# Altium project BLDC_MOTOR_Driver_stm32f446re.PrjPcb (part 1 of 2)
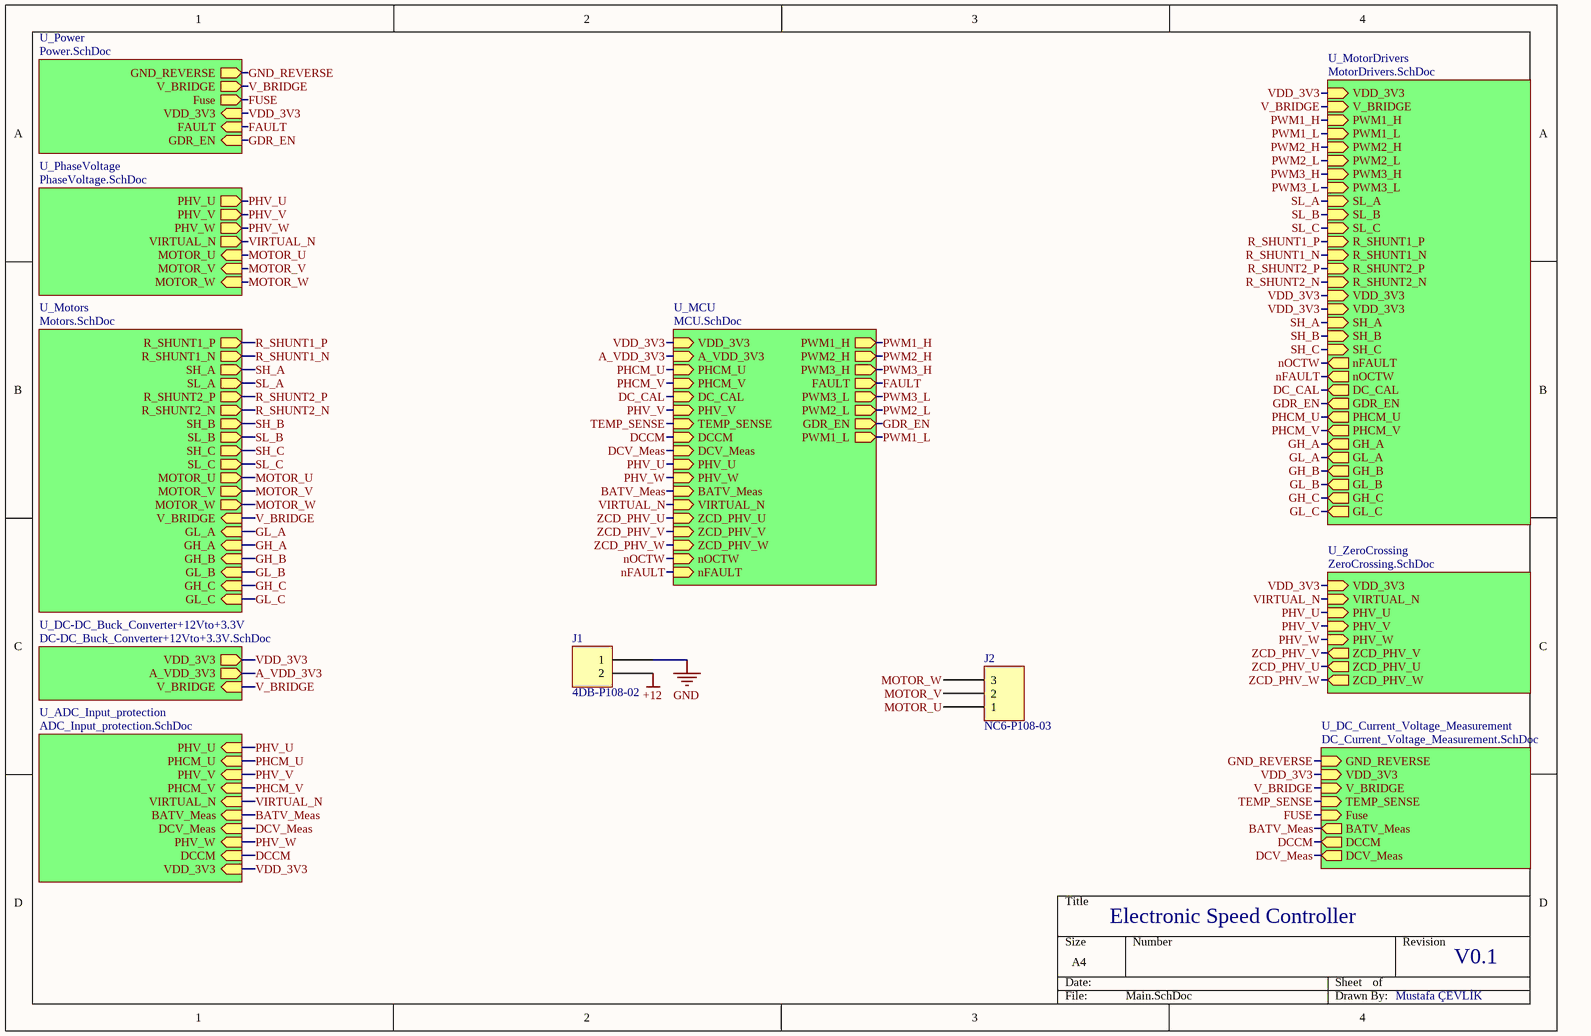
[diagram p0: Main.SchDoc]
10 sheets, 166 parts. Net scope: global (net labels, ports and power ports of the same name join across sheets).
Board file: PCB1.PcbDoc
Sheets:
  Main.SchDoc
    U_Power = Power.SchDoc
    U_PhaseVoltage = PhaseVoltage.SchDoc
    U_Motors = Motors.SchDoc
    U_DC-DC_Buck_Converter+12Vto+3.3V = DC-DC_Buck_Converter+12Vto+3.3V.SchDoc
    U_ADC_Input_protection = ADC_Input_protection.SchDoc
    U_MotorDrivers = MotorDrivers.SchDoc
    U_ZeroCrossing = ZeroCrossing.SchDoc
    U_DC_Current_Voltage_Measurement = DC_Current_Voltage_Measurement.SchDoc
    U_MCU = MCU.SchDoc

## Sheet Main.SchDoc
size A4; SheetNumber: 1; SheetTotal: 10

### Parts
J1  4DB-P108-02  [TE 4DB-P108-02]
J2  NC6-P108-03  [TE NC6-P108-03]

### Sub-sheets
U_ADC_Input_protection = ADC_Input_protection.SchDoc: PHV_U (in), PHCM_U (in), PHV_V (in), PHCM_V (in), VIRTUAL_N (in), BATV_Meas (in), DCV_Meas (in), PHV_W (in), DCCM (in), VDD_3V3 (in)
U_DC-DC_Buck_Converter+12Vto+3.3V = DC-DC_Buck_Converter+12Vto+3.3V.SchDoc: V_BRIDGE (in), VDD_3V3 (out), A_VDD_3V3 (out)
U_DC_Current_Voltage_Measurement = DC_Current_Voltage_Measurement.SchDoc: DCCM (out), GND_REVERSE (in), VDD_3V3 (in), BATV_Meas (out), V_BRIDGE (in), DCV_Meas (out), TEMP_SENSE (in), Fuse (in)
U_MCU = MCU.SchDoc: VDD_3V3 (in), A_VDD_3V3 (in), PHCM_U (in), PHCM_V (in), DC_CAL (in), PHV_V (in), TEMP_SENSE (in), PWM1_H (out), PWM2_H (out), PWM3_H (out), DCCM (in), DCV_Meas (in), PHV_U (in), FAULT (out), PWM3_L (out), PHV_W (in), BATV_Meas (in), PWM2_L (out), VIRTUAL_N (in), ZCD_PHV_U (in), ZCD_PHV_V (in), ZCD_PHV_W (in), nOCTW (in), nFAULT (in), GDR_EN (out), PWM1_L (out)
U_MotorDrivers = MotorDrivers.SchDoc: VDD_3V3 (in), V_BRIDGE (in), nFAULT (out), nOCTW (out), DC_CAL (out), GDR_EN (out), PWM1_H (in), PWM1_L (in), PWM2_H (in), PWM2_L (in), PWM3_H (in), PWM3_L (in), PHCM_U (out), PHCM_V (out), GH_A (out), GL_A (out), SL_A (in), GH_B (out), GL_B (out), SL_B (in), GH_C (out), GL_C (out), SL_C (in), R_SHUNT1_P (in), R_SHUNT1_N (in), R_SHUNT2_P (in), R_SHUNT2_N (in), VDD_3V3 (in), VDD_3V3 (in), SH_A (in), SH_B (in), SH_C (in)
U_Motors = Motors.SchDoc: V_BRIDGE (in), R_SHUNT1_P (out), R_SHUNT1_N (out), GL_A (in), SH_A (out), SL_A (out), GH_A (in), R_SHUNT2_P (out), R_SHUNT2_N (out), SH_B (out), SL_B (out), GH_B (in), GL_B (in), SH_C (out), SL_C (out), GH_C (in), GL_C (in), MOTOR_U (out), MOTOR_V (out), MOTOR_W (out)
U_PhaseVoltage = PhaseVoltage.SchDoc: MOTOR_U (in), MOTOR_V (in), MOTOR_W (in), PHV_U (out), PHV_V (out), PHV_W (out), VIRTUAL_N (out)
U_Power = Power.SchDoc: GND_REVERSE (out), V_BRIDGE (out), VDD_3V3 (in), FAULT (in), GDR_EN (in), Fuse (out)
U_ZeroCrossing = ZeroCrossing.SchDoc: VDD_3V3 (in), VIRTUAL_N (in), ZCD_PHV_U (out), PHV_U (in), ZCD_PHV_V (out), PHV_V (in), ZCD_PHV_W (out), PHV_W (in)

### Nets
+12: J1.2
R_SHUNT1_N: J1.1 ; sheet U_Motors/R_SHUNT1_N, sheet U_Motors/R_SHUNT2_N, sheet U_MotorDrivers/R_SHUNT1_N, sheet U_MotorDrivers/R_SHUNT2_N  [also labelled GND, R_SHUNT2_N]
A_VDD_3V3: sheet U_DC-DC_Buck_Converter+12Vto+3.3V/A_VDD_3V3, sheet U_MCU/A_VDD_3V3
BATV_Meas: sheet U_ADC_Input_protection/BATV_Meas, sheet U_DC_Current_Voltage_Measurement/BATV_Meas, sheet U_MCU/BATV_Meas
DC_CAL: sheet U_MotorDrivers/DC_CAL, sheet U_MCU/DC_CAL
DCCM: sheet U_ADC_Input_protection/DCCM, sheet U_DC_Current_Voltage_Measurement/DCCM, sheet U_MCU/DCCM
DCV_Meas: sheet U_ADC_Input_protection/DCV_Meas, sheet U_DC_Current_Voltage_Measurement/DCV_Meas, sheet U_MCU/DCV_Meas
FAULT: sheet U_Power/FAULT, sheet U_MCU/FAULT
FUSE: sheet U_Power/Fuse, sheet U_DC_Current_Voltage_Measurement/Fuse
GDR_EN: sheet U_Power/GDR_EN, sheet U_MotorDrivers/GDR_EN, sheet U_MCU/GDR_EN
GH_A: sheet U_Motors/GH_A, sheet U_MotorDrivers/GH_A
GH_B: sheet U_Motors/GH_B, sheet U_MotorDrivers/GH_B
GH_C: sheet U_Motors/GH_C, sheet U_MotorDrivers/GH_C
GL_A: sheet U_Motors/GL_A, sheet U_MotorDrivers/GL_A
GL_B: sheet U_Motors/GL_B, sheet U_MotorDrivers/GL_B
GL_C: sheet U_Motors/GL_C, sheet U_MotorDrivers/GL_C
GND_REVERSE: sheet U_Power/GND_REVERSE, sheet U_DC_Current_Voltage_Measurement/GND_REVERSE
MOTOR_U: J2.1 ; sheet U_PhaseVoltage/MOTOR_U, sheet U_Motors/SH_A, sheet U_Motors/MOTOR_U, sheet U_MotorDrivers/SH_A  [also labelled SH_A]
MOTOR_V: J2.2 ; sheet U_PhaseVoltage/MOTOR_V, sheet U_Motors/SH_B, sheet U_Motors/MOTOR_V, sheet U_MotorDrivers/SH_B  [also labelled SH_B]
MOTOR_W: J2.3 ; sheet U_PhaseVoltage/MOTOR_W, sheet U_Motors/SH_C, sheet U_Motors/MOTOR_W, sheet U_MotorDrivers/SH_C  [also labelled SH_C]
nFAULT: sheet U_MotorDrivers/nOCTW, sheet U_MCU/nFAULT
nOCTW: sheet U_MotorDrivers/nFAULT, sheet U_MCU/nOCTW
PHCM_U: sheet U_ADC_Input_protection/PHCM_U, sheet U_MotorDrivers/PHCM_U, sheet U_MCU/PHCM_U
PHCM_V: sheet U_ADC_Input_protection/PHCM_V, sheet U_MotorDrivers/PHCM_V, sheet U_MCU/PHCM_V
PHV_U: sheet U_PhaseVoltage/PHV_U, sheet U_ADC_Input_protection/PHV_U, sheet U_ZeroCrossing/PHV_U, sheet U_MCU/PHV_U
PHV_V: sheet U_PhaseVoltage/PHV_V, sheet U_ADC_Input_protection/PHV_V, sheet U_ZeroCrossing/PHV_V, sheet U_MCU/PHV_V
PHV_W: sheet U_PhaseVoltage/PHV_W, sheet U_ADC_Input_protection/PHV_W, sheet U_ZeroCrossing/PHV_W, sheet U_MCU/PHV_W
PWM1_H: sheet U_MotorDrivers/PWM1_H, sheet U_MCU/PWM1_H
PWM1_L: sheet U_MotorDrivers/PWM1_L, sheet U_MCU/PWM1_L
PWM2_H: sheet U_MotorDrivers/PWM2_H, sheet U_MCU/PWM2_H
PWM2_L: sheet U_MotorDrivers/PWM2_L, sheet U_MCU/PWM2_L
PWM3_H: sheet U_MotorDrivers/PWM3_H, sheet U_MCU/PWM3_H
PWM3_L: sheet U_MotorDrivers/PWM3_L, sheet U_MCU/PWM3_L
R_SHUNT1_P: sheet U_Motors/R_SHUNT1_P, sheet U_Motors/SL_A, sheet U_MotorDrivers/SL_A, sheet U_MotorDrivers/R_SHUNT1_P  [also labelled SL_A]
R_SHUNT2_P: sheet U_Motors/R_SHUNT2_P, sheet U_Motors/SL_B, sheet U_MotorDrivers/SL_B, sheet U_MotorDrivers/R_SHUNT2_P  [also labelled SL_B]
SL_C: sheet U_Motors/SL_C, sheet U_MotorDrivers/SL_C
TEMP_SENSE: sheet U_DC_Current_Voltage_Measurement/TEMP_SENSE, sheet U_MCU/TEMP_SENSE
V_BRIDGE: sheet U_Power/V_BRIDGE, sheet U_Motors/V_BRIDGE, sheet U_DC-DC_Buck_Converter+12Vto+3.3V/V_BRIDGE, sheet U_MotorDrivers/V_BRIDGE, sheet U_DC_Current_Voltage_Measurement/V_BRIDGE
VDD_3V3: sheet U_Power/VDD_3V3, sheet U_DC-DC_Buck_Converter+12Vto+3.3V/VDD_3V3, sheet U_ADC_Input_protection/VDD_3V3, sheet U_MotorDrivers/VDD_3V3, sheet U_MotorDrivers/VDD_3V3, sheet U_MotorDrivers/VDD_3V3, sheet U_ZeroCrossing/VDD_3V3, sheet U_DC_Current_Voltage_Measurement/VDD_3V3, sheet U_MCU/VDD_3V3
VIRTUAL_N: sheet U_PhaseVoltage/VIRTUAL_N, sheet U_ADC_Input_protection/VIRTUAL_N, sheet U_ZeroCrossing/VIRTUAL_N, sheet U_MCU/VIRTUAL_N
ZCD_PHV_U: sheet U_ZeroCrossing/ZCD_PHV_U, sheet U_MCU/ZCD_PHV_U
ZCD_PHV_V: sheet U_ZeroCrossing/ZCD_PHV_V, sheet U_MCU/ZCD_PHV_V
ZCD_PHV_W: sheet U_ZeroCrossing/ZCD_PHV_W, sheet U_MCU/ZCD_PHV_W

### Notes on the sheet
- Electronic Speed Controller
- V0.1
- Mustafa ÇEVLİK

### Library data of the parts
J1 = 4DB-P108-02: CONN BARRIER STRIP 2CIRC 0.325"; Manufacturer: TE Connectivity AMP Connectors; Barrier Type: 2 Wall (Dual); Bottom Termination: PC Pin; Current Rating (Amps): 20A; Number of Circuits: 2; Pitch: 0.325" (8.26mm); Top Termination: Screws with Captive Plate; Voltage Rating: 150V; Wire Gauge: 12-22 AWG; Part Number: 4DB-P108-02; Color: Black; ComponentLink1Description: Datasheet; ComponentLink1URL: https://www.te.com/commerce/DocumentDelivery/DDEController?Action=srchrtrv&DocNm=2-1437667-4&DocType=Customer+Drawing&DocLang=English; ComponentLink2Description: DigiKey Link; ComponentLink2URL: http://digikey.com/product-detail/en/te-connectivity-amp-connectors/4DB-P108-02/A98472-ND/1277921; LastUpdated: 15.01.2020 04:14:08; Lifecycle Status: Active; Minimum Order: 1; Number of Rows: 1; Number of Wire Entries: 2; Packaging: Bulk; Part Status: Active; Price: 1.04; Series: 4DB, Buchanan; Supplier 1: DigiKey; Supplier Part Number 1: A98472-ND; Terminal Block Type: Barrier Block
J2 = NC6-P108-03: CONN BARRIER STRIP 3CIRC 0.375"; Manufacturer: TE Connectivity AMP Connectors; Barrier Type: 2 Wall (Dual); Bottom Termination: PC Pin; Current Rating (Amps): 20A; Number of Circuits: 3; Pitch: 0.375" (9.53mm); Top Termination: Screws with Captive Plate; Voltage Rating: 300V; Wire Gauge: 12-22 AWG; Part Number: NC6-P108-03; Color: Black; ComponentLink1Description: Datasheet; ComponentLink1URL: https://www.te.com/commerce/DocumentDelivery/DDEController?Action=srchrtrv&DocNm=3-1437664-0&DocType=Customer+Drawing&DocLang=English; ComponentLink2Description: DigiKey Link; ComponentLink2URL: http://digikey.com/product-detail/en/te-connectivity-amp-connectors/NC6-P108-03/A98496-ND/1277927; LastUpdated: 15.01.2020 04:12:05; Lifecycle Status: Active; Minimum Order: 1; Number of Rows: 1; Number of Wire Entries: 3; Packaging: Bulk; Part Status: Active; Price: 2.16; Series: NC6, Buchanan; Supplier 1: DigiKey; Supplier Part Number 1: A98496-ND; Terminal Block Type: Barrier Block

## Sheet Power.SchDoc
size A4; SheetNumber: 2; SheetTotal: 10
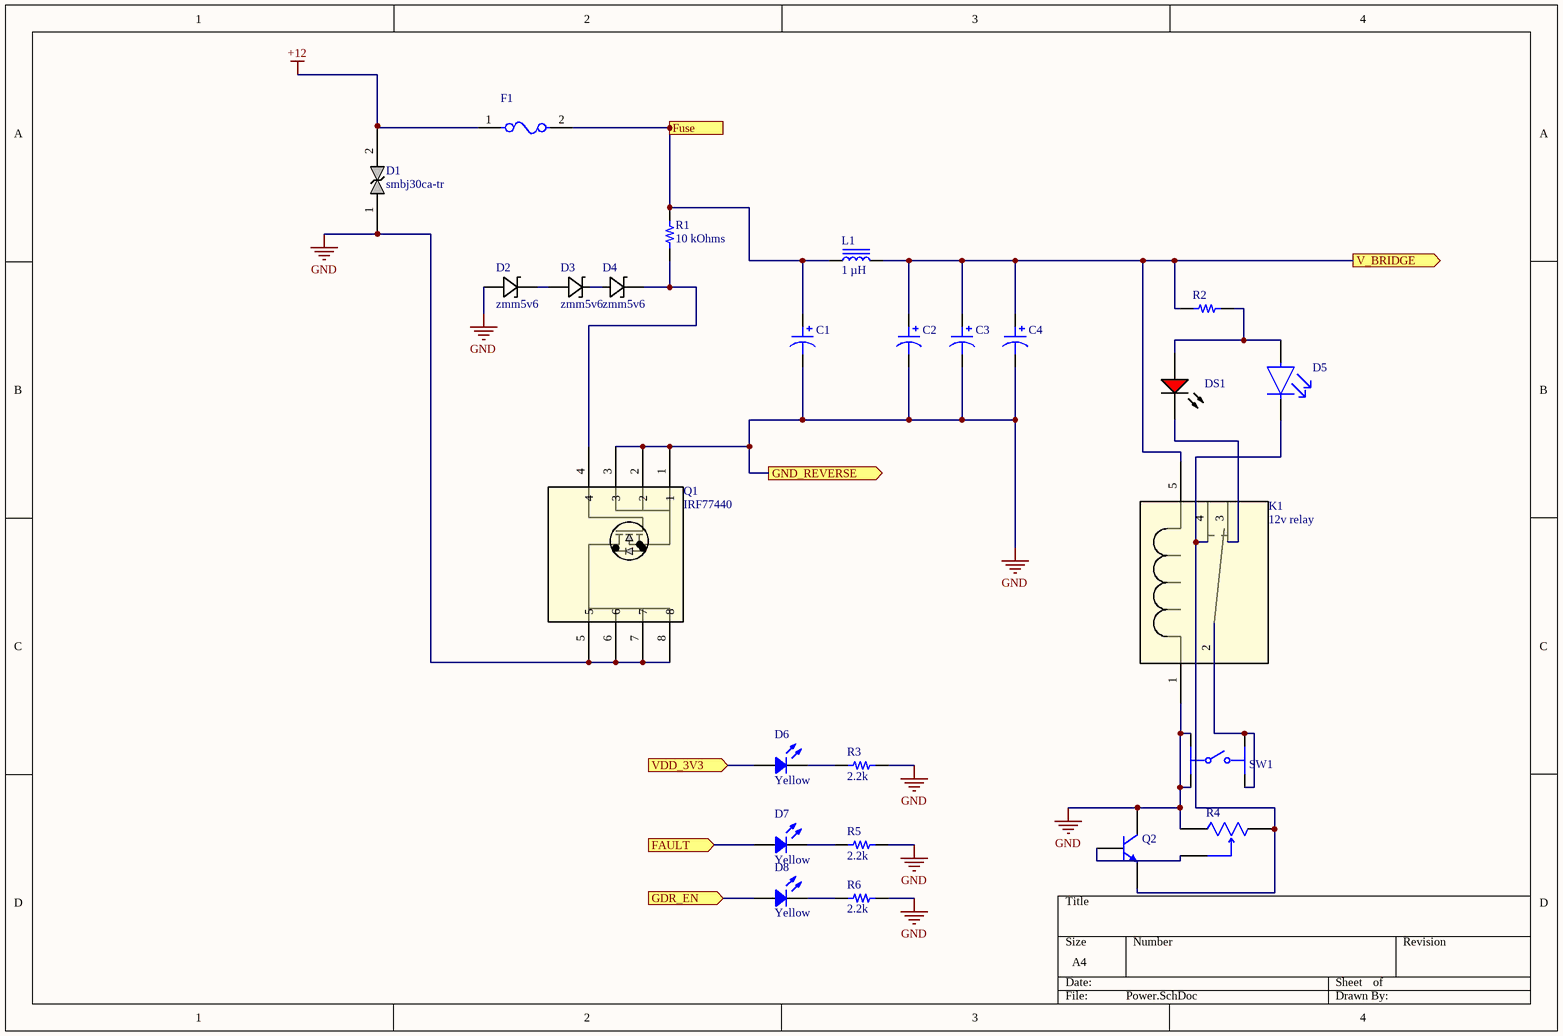
[diagram p1: Power.SchDoc]

### Parts
C1  100 µF  [CAP POL 1411_3528]  (value not drawn)
C2  100 µF  [CAP POL 1411_3528]  (value not drawn)
C3  100 µF  [CAP POL 1411_3528]  (value not drawn)
C4  100 µF  [CAP POL 1411_3528]  (value not drawn)
D1  smbj30ca-tr  [smbj30ca-tr]
D2  zmm5v6  [zmm5v6]
D3  zmm5v6  [zmm5v6]
D4  zmm5v6  [zmm5v6]
D5  LTST-C190GKT  [FP-LTST-C190GKT-MFG]  (value not drawn)
D6  Yellow  [LED 0402_1005 YELLOW]
D7  Yellow  [LED 0402_1005 YELLOW]
D8  Yellow  [LED 0402_1005 YELLOW]
DS1  TLMS1100-GS08  [VISH-TLMX1100_V]  (value not drawn)
F1  SF-2923UC60C-2  [FP-SF-2923-MFG]  (value not drawn)
K1  12v relay  [12V relay]
L1  1 µH  [WURTH WE-HCI 7040]
Q1  IRF77440  [IRF77440]
Q2  BC547B  [ONSC-TO-92-3-29-11]  (value not drawn)
R1  10 kOhms  [RES 0603_1608]
R2  1 kOhms  [RES 1206_3216]  (value not drawn)
R3  2.2k  [RES 0603_1608]
R4  TS53YJ104MR10  [FP-TS53YJ-MFG]  (value not drawn)
R5  2.2k  [RES 0603_1608]
R6  2.2k  [RES 0603_1608]
SW1  3-1825910-1  [FP-3-1825910-1-MFG]  (value not drawn)

### Ports
FAULT (in, see MCU[3C]), Fuse (out, see DC_Current_Voltage_Measurement[2B]), GDR_EN (in, see MCU[3B], MotorDrivers[1B]), GND_REVERSE (out, see DC_Current_Voltage_Measurement[2A]), V_BRIDGE (out, see DC-DC_Buck_Converter+12Vto+3.3V[1A], DC_Current_Voltage_Measurement[3B], MotorDrivers[3C], Motors[1A]), VDD_3V3 (in, see ADC_Input_protection[3C], DC-DC_Buck_Converter+12Vto+3.3V[3C], DC_Current_Voltage_Measurement[3B], MCU[1B], MotorDrivers[1A], MotorDrivers[1B], ZeroCrossing[1A])

### Nets
+12: D1.2 F1.1
GND: C1.2 C2.2 C3.2 C4.2 D1.1 D2.2(ANODE) K1.1 Q1.1 Q1.2 Q1.3 Q1.5 Q1.6 Q1.7 Q1.8 Q2.1(C) R3.1 R4.1(a) R5.1 R6.1 SW1.1 SW1.2 ; port GND_REVERSE  [project net R_SHUNT1_N]
GDR_EN: D8.1 ; port GDR_EN
NetC1_1: C1.1 F1.2 L1.1 R1.2 ; port Fuse
NetC2_1: C2.1 C3.1 C4.1 K1.5 L1.2 R2.2 ; port V_BRIDGE
NetC11_1: D6.1 ; port VDD_3V3
NetD2_1: D2.1(CATHODE) D3.2(ANODE)
NetD3_1: D3.1(CATHODE) D4.2(ANODE)
NetD4_1: D4.1(CATHODE) Q1.4 R1.1
NetD5_1: D5.1(C) K1.4 Q2.3(E) R4.3(c)
NetD5_2: D5.2(A) DS1.1(A) R2.1
NetD6_2: D6.2 R3.2
NetD7_1: D7.1 ; port FAULT
NetD7_2: D7.2 R5.2
NetD8_2: D8.2 R6.2
NetDS1_2: DS1.2(K) K1.3
NetK1_2: K1.2 SW1.3 SW1.4
NetQ2_2: Q2.2(B) R4.2(b)

### Library data of the parts
C1-C4 = T495B107M006ATE700: CAP TANT 100UF 20% 6.3V 1411; manufacturer: KEMET; Manufacturer Size Code: B; ESR (Equivalent Series Resistance): 700mOhm; Lifetime @ Temp.: 2000 Hrs @ 85°C; Type: Molded; Part Number: T495B107M006ATE700; Value: 100 µF; Capacitance: 100 µF; componentlink1description: Datasheet; componentlink1url: https://api.kemet.com/component-edge/download/datasheet/T495B107M006ATE700.pdf; componentlink2description: DigiKey Link; componentlink2url: https://www.digikey.com/en/products/detail/kemet/T495B107M006ATE700/818735; Device Package: 1411 (3528 Metric); Features: General Purpose; Height - Seated (Max): 0.083" (2.10mm); lastupdated: 3.10.2023 19:55:50; Lifecycle Status: Active; Minimum Order: 1; Mounting Type: Surface Mount; Operating Temperature: -55°C ~ 125°C; Package / Case: 1411 (3528 Metric); packaging: TapeAndReel; partid: 29; Part Status: Active; price: 0.54; series: T495; Size / Dimension: 0.138" L x 0.110" W (3.50mm x 2.80mm); Supplier 1: DigiKey; Supplier Part Number 1: 399-3875-1-ND; Tolerance: ±20%; Voltage - Rated: 6.3 V
D5 = CMP-22017-000005-2: LED GREEN CLEAR CHIP SMD; Dominant Wavelength: 569nm; Reverse Voltage: 5V; Lens Color: Colorless; Viewing Angle: 130°; Voltage: 2V; Forward Current: 30mA; Power Dissipation: 100mW; Luminous Intensity: 6mcd; Number of LEDs: 1; Forward Voltage: 2.1V; Wavelength: 565nm; Test Current: 10mA; Min Operating Temperature: -55°C; Lens Style: Clear; Mount: Surface Mount; Width: 0.8mm; Packaging: Tape and Reel; Lens Transparency: Clear; Case Code (Metric): 1608; Depth: 0.8mm; Case Code (Imperial): 0603; Case/Package: 0603; Number of Pins: 2; Max Operating Temperature: 85°C; Lead Free: Lead Free; Number of Elements: 1; Length: 1.6mm; Height: 0.8mm; Package Quantity: 1; Power Rating: 100mW; Radiation Hardening: No; Illumination Color: Green; Color: Green
D6-D8 = 5988A40107F: SM LED 0402 YEL 590NM; Manufacturer: Dialight; Configuration: 0402; Current - Test: 5mA; Lens Color: 0.60mm; Lens Size: 1.00mm x 0.50mm; Lens Style: Rectangle with Flat Top; Millicandela Rating: 42mcd; Voltage - Forward (Vf) (Typ): 1.8V; Wavelength - Dominant: 591nm; Part Number: 5988A40107F; Color: Yellow; ComponentLink1Description: Datasheet; ComponentLink1URL: http://www.dialightsignalsandcomponents.com/Assets/Drawings/2D_Drawings_DrawingDetailedSpec/NewDrawings/C18402A.pdf; ComponentLink2Description: DigiKey Link; ComponentLink2URL: https://www.digikey.com/en/products/detail/dialight/5988A40107F/10108965; Device Package: 0402 (1005 Metric); Height (Max): 0.60mm; LastUpdated: 8.10.2023 20:19:46; Lifecycle Status: Active; Minimum Order: 1; Mounting Type: Surface Mount; Package / Case: 0402 (1005 Metric); Packaging: TapeAndReel; PartId: 164; Part Status: Active; Price: 0.06; Series: 598; Size / Dimension: 1.00mm L x 0.50mm W; Supplier 1: DigiKey; Supplier Part Number 1: 350-4449-1-ND; Supplier Device Package: 0402; Value: Yellow
DS1 = CMP-1666-00027-1: LED, RED, 2.1 V, -40 to 100 degC, 2-Pin SMD (0603), RoHS, Tape and Reel; Type (Capacitors): C0G; Resistance: 100000000000 Ohm; Capacitance: 12 pF; Voltage Rating: 50 V; Tolerance: 5%; Min Operating Temperature: -55degC; REACH SVHC: No SVHC; ComponentLink2Description: Datasheet; ComponentLink1URL: http://www.vishay.com/; Width: 0.8 mm; Package Quantity: 4000; PackageReference: TLMX1100; ComponentLink2URL: http://www.vishay.com/docs/83173/tlmb1100.pdf; Case/Package: 0603; Case Code (Metric): 1608; Packaging: Tape and Reel; Pins: 2; ComponentLink1Description: Manufacturer URL; Max Operating Temperature: 125degC; Height: 0.8 mm; Length: 1.6 mm; Mount: Surface Mount; PackageDescription: 2-Pin Surface Mount Device, Body 1.6 x 0.8 mm; DatasheetVersion: Rev. 2.7, 03/2016; Case Code (Imperial): 0603; Voltage Rating (DC): 50 V; RoHSCompliant: True; Radiation Hardening: No
F1 = CMP-07399-000001-1: SINGLFUSE 2923 ULTRA-HIGH-I 80VD; Manufacturer: Bourns; Fuse Current: 60A; Value: 0.00065Ω; Max Fuse Dc Voltage: 80V; Fuse Blow Speed: Fast; Fuse Interrupt Dc Current: 450A; Fuse I2T: 1260A2Sec; Temperature: -55°C to +125°C; Category: Fuse; Lead Free: Yes; RoHS: TRUE; Device Class L1: Circuit Protection; Temperature Range Low: -55°C; Manufacturer Part Number: SF-2923UC60C-2; Automotive: No; Octopart: https://octopart.com/sf-2923uc60c-2-bourns-98542147; Height: 4.2mm; Package: SF-2923; ComponentLink2URL: http://www.bourns.com/docs/Product-Datasheets/SF-2923uc.pdf; Device Class L2: Fuses; Voltage Rating: 80V; Device Class L3: unset; ComponentLink2Description: Datasheet; Digikey Description: SINGLFUSE 2923 ULTRA-HIGH-I 80VD; Resistance: 0.00065Ω; Temperature Range High: +125°C
L1 = 744311100: FIXED IND 1UH 15A 4.6 MOHM SMD; Manufacturer: Würth Elektronik; Current - Saturation: 19A; Frequency - Self Resonant: 85MHz; Inductance Frequency - Test: 100 kHz; Material - Core: Nonstandard; Shielding: Shielded; Tolerance: ±20%; Type: Wirewound; Part Number: 744311100; ComponentLink1Description: Datasheet; ComponentLink1URL: https://katalog.we-online.de/pbs/datasheet/744311100.pdf; ComponentLink2Description: DigiKey Link; ComponentLink2URL: https://www.digikey.com/en/products/detail/würth-elektronik/744311100/3476747; Current Rating (Amps): 15 A; DC Resistance (DCR): 4.6mOhm; Device Package: Nonstandard; Height - Seated (Max): 0.157" (4.00mm); Inductance: 1 µH; LastUpdated: 3.10.2023 20:25:36; Lifecycle Status: Active; Minimum Order: 1; Mounting Type: Surface Mount; Operating Temperature: -40°C ~ 150°C; Package / Case: Nonstandard; Packaging: TapeAndReel; PartId: 260; Part Status: Active; Price: 2.72; Ratings: AEC-Q200; Series: WE-HCI; Size / Dimension: 0.276" L x 0.272" W (7.00mm x 6.90mm); Supplier 1: DigiKey; Supplier Part Number 1: 732-4177-1-ND; Supplier Device Package: 7040; Value: 1 µH
Q2 = CMP-1048-01467-1: Amplifier Transistor, NPN Silicon, 3-Pin TO-92, Bulk Box; Manufacturer: On Semiconductor; IC Continuous (A): 0.1; fT Min (MHz): 150; DatasheetVersion: Rev. 7; ComponentLink1URL: http://www.onsemi.com/; Polarity: NPN; RoHS: FALSE; ComponentLink1Description: Manufacturer URL; Packing: Bulk Box; PackageDescription: 3-Pin Transistor Outline, Body 4.825 x 3.685 mm, Pitch 1.27 mm; ComponentLink3URL: http://www.onsemi.cn/pub_link/Collateral/2N6426-D.PDF; ComponentLink2Description: Datasheet; PackageVersion: Rev. AM; PackageReference: TO-92-3-29-11_AM_SL; ComponentLink3Description: Package Specification; Mounting Technology: Through Hole; PartNumber: BC547B; ComponentLink2URL: http://www.onsemi.com/pub_link/Collateral/BC546-D.PDF
R1 = RM06F1002CT: RES0603 1% 10K OHM; Manufacturer: Cal-Chip Electronics, Inc.; Power (Watts): 0.1W, 1/10W; Temperature Coefficient: ±100ppm/°C; Part Number: RM06F1002CT; Value: 10 kOhms; ComponentLink2Description: DigiKey Link; ComponentLink2URL: https://www.digikey.com/en/products/detail/cal-chip-electronics-inc/RM06F1002CT/18151076; Composition: Thick Film; Device Package: 0603 (1608 Metric); Height - Seated (Max): 0.022" (0.55mm); LastUpdated: 3.10.2023 19:33:57; Lifecycle Status: Active; Minimum Order: 1; Number of Terminations: 2; Operating Temperature: -55°C ~ 155°C; Package / Case: 0603 (1608 Metric); Packaging: CutTape; PartId: 76557; Part Status: Active; Price: 0.01; Resistance: 10 kOhms; Series: RM; Size / Dimension: 0.063" L x 0.031" W (1.60mm x 0.80mm); Supplier 1: DigiKey; Supplier Part Number 1: 4713-RM06F1002CT-ND; Supplier Device Package: 0603; Tolerance: ±1%
R2 = RNCP1206FTD1K00: RES 1K OHM 1% 1/2W 1206; Manufacturer: Stackpole Electronics Inc; Power (Watts): 0.5W, 1/2W; Temperature Coefficient: ±100ppm/°C; Part Number: RNCP1206FTD1K00; ComponentLink1Description: Datasheet; ComponentLink1URL: https://www.seielect.com/catalog/sei-rncp.pdf; ComponentLink2Description: DigiKey Link; ComponentLink2URL: https://www.digikey.com/en/products/detail/stackpole-electronics-inc/RNCP1206FTD1K00/2240337; Composition: Thin Film; Device Package: 1206 (3216 Metric); Features: Anti-Sulfur; Height - Seated (Max): 0.025" (0.65mm); LastUpdated: 12.10.2023 19:48:17; Lifecycle Status: Active; Minimum Order: 1; Number of Terminations: 2; Operating Temperature: -55°C ~ 155°C; Package / Case: 1206 (3216 Metric); Packaging: TapeAndReel; PartId: 26970; Part Status: Active; Price: 0.01; Resistance: 1 kOhms; Series: RNCP; Size / Dimension: 0.122" L x 0.059" W (3.10mm x 1.50mm); Supplier 1: DigiKey; Supplier Part Number 1: RNCP1206FTD1K00CT-ND; Supplier Device Package: 1206; Tolerance: ±1%; Value: 1 kOhms
R3 R5 R6 = RM06F1002CT: RES0603 1% 10K OHM; Manufacturer: Cal-Chip Electronics, Inc.; Power (Watts): 0.1W, 1/10W; Resistance: 2.2kOhms; Temperature Coefficient: ±100ppm/°C; Part Number: RM06F1002CT; Value: 2.2k; ComponentLink2Description: DigiKey Link; ComponentLink2URL: https://www.digikey.com/en/products/detail/cal-chip-electronics-inc/RM06F1002CT/18151076; Composition: Thick Film; Device Package: 0603 (1608 Metric); Height - Seated (Max): 0.022" (0.55mm); LastUpdated: 3.10.2023 19:33:57; Lifecycle Status: Active; Minimum Order: 1; Number of Terminations: 2; Operating Temperature: -55°C ~ 155°C; Package / Case: 0603 (1608 Metric); Packaging: CutTape; PartId: 76557; Part Status: Active; Price: 0.01; Series: RM; Size / Dimension: 0.063" L x 0.031" W (1.60mm x 0.80mm); Supplier 1: DigiKey; Supplier Part Number 1: 4713-RM06F1002CT-ND; Supplier Device Package: 0603; Tolerance: ±1%
R4 = CMP-02410-000010-1: TRIMMER 100KOHM 0.25W J LEAD TOP; Power Rating: 250mW; Resistance: 100kR; Tolerance: 20%; Temperature Coefficient: 100ppm/°C; Number of Turns: 1; Package Quantity: 1; Max Operating Temperature: 125°C; Technology: CERMET; Packaging: Tape and Reel; Taper: Linear; Length: 0.197inch; Max Power Dissipation: 250mW; Military Standard: Not; Depth: 5.5mm; Series: TS53Y; RoHS Compliant: Yes; Lead Free: Lead Free; Min Operating Temperature: -55°C; Mount: Surface Mount; Resistance Tolerance: 20%; Resistor Type: Cermet; Height: 0.106inch; Width: 0.197inch; Termination: SMD/SMT; Radiation Hardening: No
SW1 = CMP-03407-000001-1: SWITCH TACTILE SPST-NO 0.05A 24V; Manufacturer: TE Connectivity; Operating Force: 160gf; Contact Current Rating: 50mA; Contact Resistance: 100mΩ; Electromechanical Life: 100000Cycles; Device Class L1: Electromechanical; ComponentLink2URL: https://www.te.com/commerce/DocumentDelivery/DDEController?Action=srchrtrv&DocNm=1825910&DocType=Customer+Drawing&DocLang=English; Category: Switch; Device Class L2: Switches; Temperature: -35°C to +85°C; RoHS: TRUE; Mount: Through Hole; Manufacturer Part Number: 3-1825910-1; Automotive: No; Lead Free: Yes; Device Class L3: Tactile Switches; ComponentLink2Description: Datasheet; Temperature Range High: +85°C; Height: 17.3mm; Package: 0; Temperature Range Low: -35°C; Throw Configuration: SPST-NO; Digikey Description: SWITCH TACTILE SPST-NO 0.05A 24V; Octopart: https://octopart.com/3-1825910-1-te+connectivity-46506874

## Sheet PhaseVoltage.SchDoc
size A4; SheetNumber: 6; SheetTotal: 10
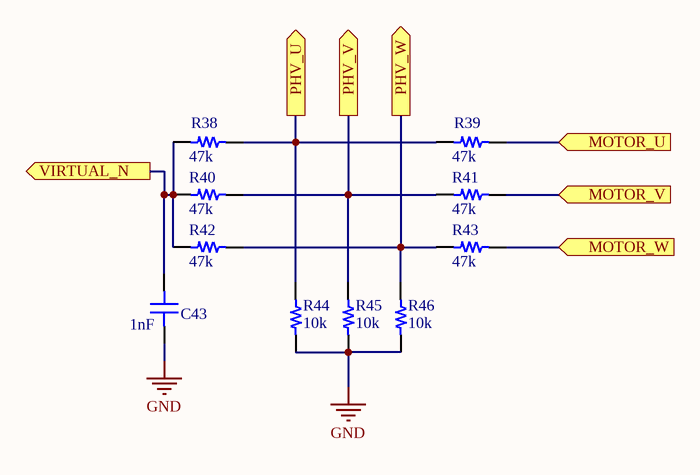
[diagram p2: PhaseVoltage.SchDoc]

### Parts
C43  1nF  [CAP 0603_1608]
R38  47k  [RES 0402_1005]
R39  47k  [RES 0402_1005]
R40  47k  [RES 0402_1005]
R41  47k  [RES 0402_1005]
R42  47k  [RES 0402_1005]
R43  47k  [RES 0402_1005]
R44  10k  [RES 0402_1005]
R45  10k  [RES 0402_1005]
R46  10k  [RES 0402_1005]

### Ports
MOTOR_U (in, see Motors[3D]), MOTOR_V (in, see Motors[3D]), MOTOR_W (in, see Motors[3D]), PHV_U (out, see ADC_Input_protection[2B], MCU[3C], ZeroCrossing[2B]), PHV_V (out, see ADC_Input_protection[3B], MCU[3B], ZeroCrossing[2B]), PHV_W (out, see ADC_Input_protection[3B], MCU[3C], ZeroCrossing[2C]), VIRTUAL_N (out, see ADC_Input_protection[4B], MCU[3C], ZeroCrossing[1B])

### Nets
GND: C43.1 C43.2 R38.1 R40.1 R42.1 R44.1 R45.1 R46.1 ; port VIRTUAL_N  [project net R_SHUNT1_N]
MOTOR_U: R39.2 ; port MOTOR_U
MOTOR_V: R41.2 ; port MOTOR_V
MOTOR_W: R43.2 ; port MOTOR_W
NetC45_2: R38.2 R39.1 R44.2 ; port PHV_U
NetC47_2: R40.2 R41.1 R45.2 ; port PHV_V
NetC49_2: R42.2 R43.1 R46.2 ; port PHV_W

### Library data of the parts
C43 = 0603ZC102KAT2A: CAP CER 1000PF 10V X7R 0603; manufacturer: AVX Corporation; Tolerance: ±10%; Part Number: 0603ZC102KAT2A; Value: 1nF; Applications: General Purpose; Capacitance: 1nF; componentlink1description: Datasheet; componentlink1url: http://datasheets.avx.com/X7RDielectric.pdf; componentlink2description: DigiKey Link; componentlink2url: http://digikey.com/product-detail/en/avx-corporation/0603ZC102KAT2A/478-0603ZC102KAT2ACT-ND/11570315; Device Package: 0603 (1608 Metric); lastupdated: 2.09.2020 01:02:55; Lifecycle Status: Active; Minimum Order: 1; Mounting Type: Surface Mount, MLCC; Operating Temperature: -55°C ~ 125°C; Package / Case: 0603 (1608 Metric); packaging: TapeAndReel; partid: 27370; Part Status: Active; price: 0.01; series: -; Supplier 1: DigiKey; Supplier Part Number 1: 478-0603ZC102KAT2ACT-ND; Temperature Coefficient: X7R; Voltage - Rated: 10V
R38-R41 = ESR01MZPF47R0: ANTI-SURGE CHIP RESISTORS; Manufacturer: Rohm Semiconductor; Power (Watts): 0.2W, 1/5W; Resistance: 47k Ohms; Temperature Coefficient: ±100ppm/°C; Tolerance: ±1%; Part Number: ESR01MZPF47R0; Value: 47k; ComponentLink1Description: Datasheet; ComponentLink1URL: https://fscdn.rohm.com/en/products/databook/datasheet/passive/resistor/chip_resistor/esr-e.pdf; ComponentLink2Description: DigiKey Link; ComponentLink2URL: https://www.digikey.com/en/products/detail/rohm-semiconductor/ESR01MZPF47R0/16180187; Composition: Thick Film; Device Package: 0402 (1005 Metric); Features: Automotive AEC-Q200, Pulse Withstanding; Height - Seated (Max): 0.016" (0.40mm); LastUpdated: 5.10.2023 19:23:22; Lifecycle Status: Active; Minimum Order: 1; Number of Terminations: 2; Operating Temperature: -55°C ~ 155°C; Package / Case: 0402 (1005 Metric); Packaging: TapeAndReel; PartId: 67421; Part Status: Active; Price: 0.03; Ratings: AEC-Q200; Series: ESR; Size / Dimension: 0.039" L x 0.020" W (1.00mm x 0.50mm); Supplier 1: DigiKey; Supplier Part Number 1: 511-ESR01MZPF47R0CT-ND; Supplier Device Package: 0402
R42 R43 = ESR01MZPF47R0: ANTI-SURGE CHIP RESISTORS; Manufacturer: Rohm Semiconductor; Power (Watts): 0.2W, 1/5W; Resistance: 47 Ohms; Temperature Coefficient: ±100ppm/°C; Tolerance: ±1%; Part Number: ESR01MZPF47R0; Value: 47k; ComponentLink1Description: Datasheet; ComponentLink1URL: https://fscdn.rohm.com/en/products/databook/datasheet/passive/resistor/chip_resistor/esr-e.pdf; ComponentLink2Description: DigiKey Link; ComponentLink2URL: https://www.digikey.com/en/products/detail/rohm-semiconductor/ESR01MZPF47R0/16180187; Composition: Thick Film; Device Package: 0402 (1005 Metric); Features: Automotive AEC-Q200, Pulse Withstanding; Height - Seated (Max): 0.016" (0.40mm); LastUpdated: 5.10.2023 19:23:22; Lifecycle Status: Active; Minimum Order: 1; Number of Terminations: 2; Operating Temperature: -55°C ~ 155°C; Package / Case: 0402 (1005 Metric); Packaging: TapeAndReel; PartId: 67421; Part Status: Active; Price: 0.03; Ratings: AEC-Q200; Series: ESR; Size / Dimension: 0.039" L x 0.020" W (1.00mm x 0.50mm); Supplier 1: DigiKey; Supplier Part Number 1: 511-ESR01MZPF47R0CT-ND; Supplier Device Package: 0402
R44 = ESR01MZPF47R0: ANTI-SURGE CHIP RESISTORS; Manufacturer: Rohm Semiconductor; Power (Watts): 0.2W, 1/5W; Resistance: 10K Ohms; Temperature Coefficient: ±100ppm/°C; Tolerance: ±1%; Part Number: ESR01MZPF47R0; Value: 10k; ComponentLink1Description: Datasheet; ComponentLink1URL: https://fscdn.rohm.com/en/products/databook/datasheet/passive/resistor/chip_resistor/esr-e.pdf; ComponentLink2Description: DigiKey Link; ComponentLink2URL: https://www.digikey.com/en/products/detail/rohm-semiconductor/ESR01MZPF47R0/16180187; Composition: Thick Film; Device Package: 0402 (1005 Metric); Features: Automotive AEC-Q200, Pulse Withstanding; Height - Seated (Max): 0.016" (0.40mm); LastUpdated: 5.10.2023 19:23:22; Lifecycle Status: Active; Minimum Order: 1; Number of Terminations: 2; Operating Temperature: -55°C ~ 155°C; Package / Case: 0402 (1005 Metric); Packaging: TapeAndReel; PartId: 67421; Part Status: Active; Price: 0.03; Ratings: AEC-Q200; Series: ESR; Size / Dimension: 0.039" L x 0.020" W (1.00mm x 0.50mm); Supplier 1: DigiKey; Supplier Part Number 1: 511-ESR01MZPF47R0CT-ND; Supplier Device Package: 0402
R45 R46 = ESR01MZPF47R0: ANTI-SURGE CHIP RESISTORS; Manufacturer: Rohm Semiconductor; Power (Watts): 0.2W, 1/5W; Resistance: 10k Ohms; Temperature Coefficient: ±100ppm/°C; Tolerance: ±1%; Part Number: ESR01MZPF47R0; Value: 10k; ComponentLink1Description: Datasheet; ComponentLink1URL: https://fscdn.rohm.com/en/products/databook/datasheet/passive/resistor/chip_resistor/esr-e.pdf; ComponentLink2Description: DigiKey Link; ComponentLink2URL: https://www.digikey.com/en/products/detail/rohm-semiconductor/ESR01MZPF47R0/16180187; Composition: Thick Film; Device Package: 0402 (1005 Metric); Features: Automotive AEC-Q200, Pulse Withstanding; Height - Seated (Max): 0.016" (0.40mm); LastUpdated: 5.10.2023 19:23:22; Lifecycle Status: Active; Minimum Order: 1; Number of Terminations: 2; Operating Temperature: -55°C ~ 155°C; Package / Case: 0402 (1005 Metric); Packaging: TapeAndReel; PartId: 67421; Part Status: Active; Price: 0.03; Ratings: AEC-Q200; Series: ESR; Size / Dimension: 0.039" L x 0.020" W (1.00mm x 0.50mm); Supplier 1: DigiKey; Supplier Part Number 1: 511-ESR01MZPF47R0CT-ND; Supplier Device Package: 0402

## Sheet Motors.SchDoc
size A4; SheetNumber: 4; SheetTotal: 10
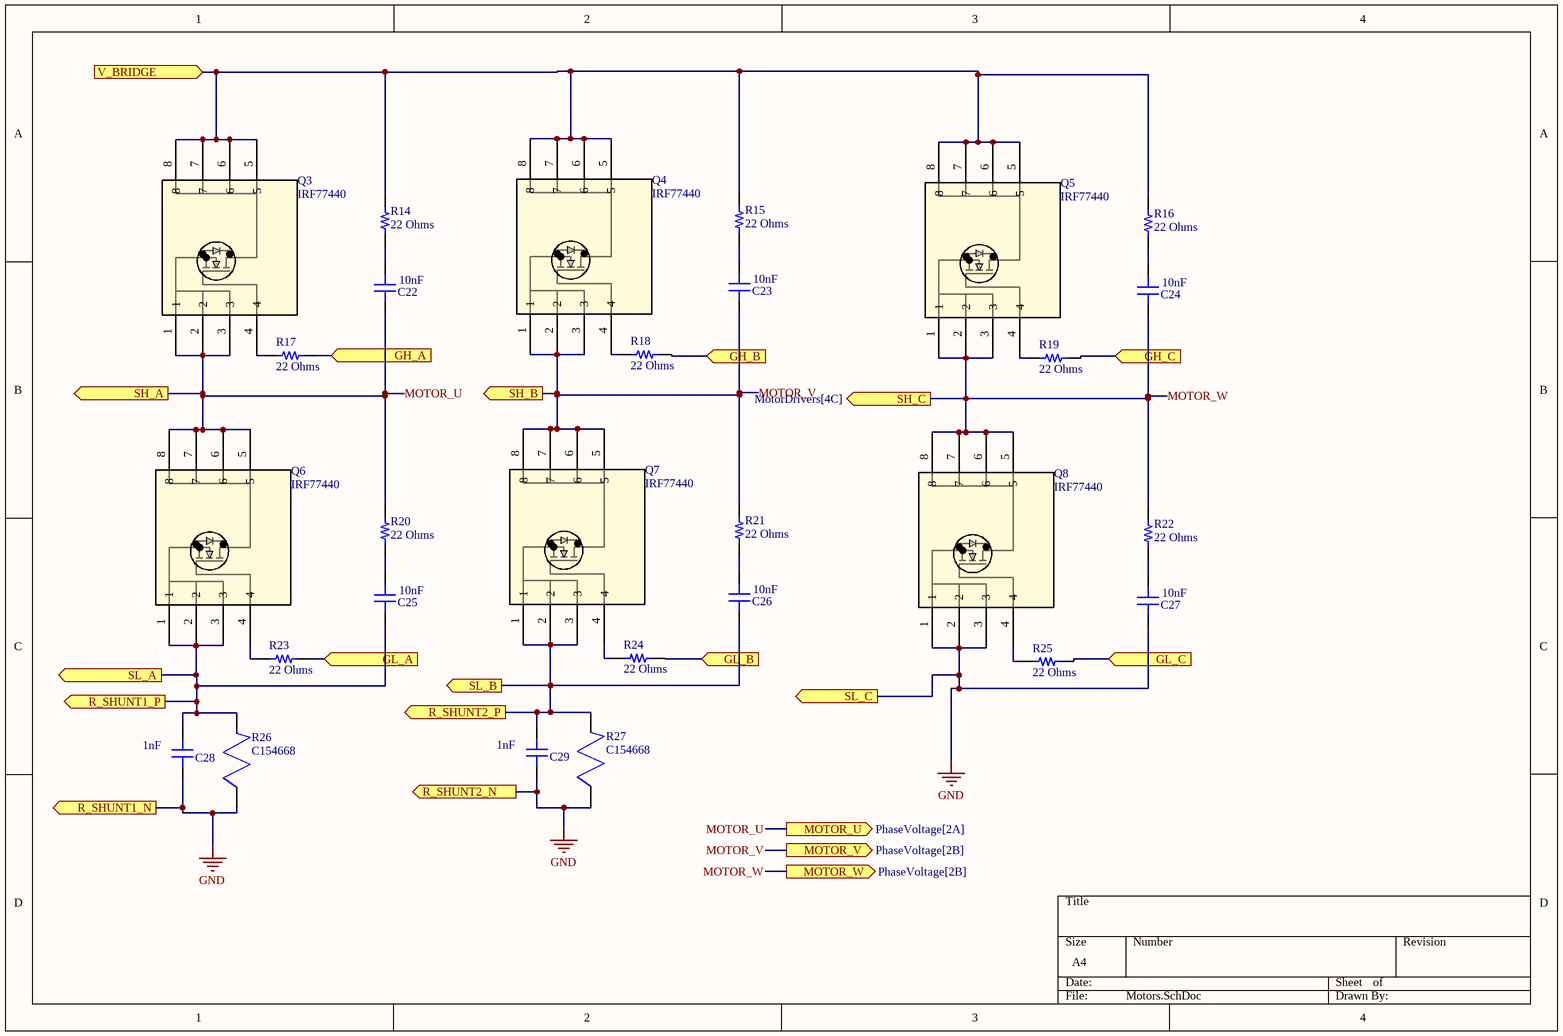
[diagram p3: Motors.SchDoc]

### Parts
C22  10nF  [CAP 0603_1608]
C23  10nF  [CAP 0603_1608]
C24  10nF  [CAP 0603_1608]
C25  10nF  [CAP 0603_1608]
C26  10nF  [CAP 0603_1608]
C27  10nF  [CAP 0603_1608]
C28  1nF  [CAP 0603_1608]
C29  1nF  [CAP 0603_1608]
Q3  IRF77440  [IRF77440]
Q4  IRF77440  [IRF77440]
Q5  IRF77440  [IRF77440]
Q6  IRF77440  [IRF77440]
Q7  IRF77440  [IRF77440]
Q8  IRF77440  [IRF77440]
R14  22 Ohms  [RES 0402_1005]
R15  22 Ohms  [RES 0402_1005]
R16  22 Ohms  [RES 0402_1005]
R17  22 Ohms  [RES 0402_1005]
R18  22 Ohms  [RES 0402_1005]
R19  22 Ohms  [RES 0402_1005]
R20  22 Ohms  [RES 0402_1005]
R21  22 Ohms  [RES 0402_1005]
R22  22 Ohms  [RES 0402_1005]
R23  22 Ohms  [RES 0402_1005]
R24  22 Ohms  [RES 0402_1005]
R25  22 Ohms  [RES 0402_1005]
R26  C154668  [C154668]
R27  C154668  [C154668]

### Ports
GH_A (in, see MotorDrivers[4A]), GH_B (in, see MotorDrivers[4A]), GH_C (in, see MotorDrivers[4B]), GL_A (in, see MotorDrivers[4A]), GL_B (in, see MotorDrivers[4A]), GL_C (in, see MotorDrivers[4B]), MOTOR_U (out, see PhaseVoltage[2A]), MOTOR_V (out, see PhaseVoltage[2B]), MOTOR_W (out, see PhaseVoltage[2B]), R_SHUNT1_N (out, see MotorDrivers[4B]), R_SHUNT1_P (out, see MotorDrivers[4B]), R_SHUNT2_N (out, see MotorDrivers[4B]), R_SHUNT2_P (out, see MotorDrivers[4B]), SH_A (out, see MotorDrivers[4B]), SH_B (out, see MotorDrivers[4C]), SH_C (out, see MotorDrivers[4C]), SL_A (out, see MotorDrivers[4A]), SL_B (out, see MotorDrivers[4B]), SL_C (out, see MotorDrivers[3B]), V_BRIDGE (in, see DC-DC_Buck_Converter+12Vto+3.3V[1A], DC_Current_Voltage_Measurement[3B], MotorDrivers[3C], Power[4A])

### Nets
GND: C27.1 C28.1 C29.1 Q8.1 Q8.2 Q8.3 R26.1 R27.1 ; port R_SHUNT1_N, port R_SHUNT2_N, port SL_C  [project net R_SHUNT1_N]
GH_A: R17.2 ; port GH_A
GH_B: R18.2 ; port GH_B
GH_C: R19.2 ; port GH_C
GL_A: R23.2 ; port GL_A
GL_B: R24.2 ; port GL_B
GL_C: R25.2 ; port GL_C
MOTOR_U: C22.1 Q3.1 Q3.2 Q3.3 Q6.5 Q6.6 Q6.7 Q6.8 R20.2 ; port SH_A, port MOTOR_U
MOTOR_V: C23.1 Q4.1 Q4.2 Q4.3 Q7.5 Q7.6 Q7.7 Q7.8 R21.2 ; port SH_B, port MOTOR_V
MOTOR_W: C24.1 Q5.1 Q5.2 Q5.3 Q8.5 Q8.6 Q8.7 Q8.8 R22.2 ; port SH_C, port MOTOR_W
R_SHUNT1_P: C25.1 C28.2 Q6.1 Q6.2 Q6.3 R26.2 ; port R_SHUNT1_P, port SL_A
R_SHUNT2_P: C26.1 C29.2 Q7.1 Q7.2 Q7.3 R27.2 ; port R_SHUNT2_P, port SL_B
NetC2_1: Q3.5 Q3.6 Q3.7 Q3.8 Q4.5 Q4.6 Q4.7 Q4.8 Q5.5 Q5.6 Q5.7 Q5.8 R14.2 R15.2 R16.2 ; port V_BRIDGE
NetC22_2: C22.2 R14.1
NetC23_2: C23.2 R15.1
NetC24_2: C24.2 R16.1
NetC25_2: C25.2 R20.1
NetC26_2: C26.2 R21.1
NetC27_2: C27.2 R22.1
NetQ3_4: Q3.4 R17.1
NetQ4_4: Q4.4 R18.1
NetQ5_4: Q5.4 R19.1
NetQ6_4: Q6.4 R23.1
NetQ7_4: Q7.4 R24.1
NetQ8_4: Q8.4 R25.1

### Library data of the parts
C22-C29 = 0603ZC102KAT2A: as C43 on sheet PhaseVoltage; Part Number: 0603ZC102KAT2A; Applications: General Purpose; componentlink1description: Datasheet; componentlink1url: http://datasheets.avx.com/X7RDielectric.pdf; componentlink2description: DigiKey Link; componentlink2url: http://digikey.com/product-detail/en/avx-corporation/0603ZC102KAT2A/478-0603ZC102KAT2ACT-ND/11570315; Device Package: 0603 (1608 Metric); lastupdated: 2.09.2020 01:02:55; Lifecycle Status: Active; Minimum Order: 1; Mounting Type: Surface Mount, MLCC; Operating Temperature: -55°C ~ 125°C; Package / Case: 0603 (1608 Metric); packaging: TapeAndReel; partid: 27370; Part Status: Active; price: 0.01; series: -; Supplier 1: DigiKey; Supplier Part Number 1: 478-0603ZC102KAT2ACT-ND; Temperature Coefficient: X7R; Voltage - Rated: 10V
  C22-C27: Value: 10nF; Capacitance: 10nF
  C28 C29: Value: 1nF; Capacitance: 1nF
R14-R25 = ESR01MZPF47R0: ANTI-SURGE CHIP RESISTORS; Manufacturer: Rohm Semiconductor; Power (Watts): 0.2W, 1/5W; Temperature Coefficient: ±100ppm/°C; Tolerance: ±1%; Part Number: ESR01MZPF47R0; Value: 22 Ohms; ComponentLink1Description: Datasheet; ComponentLink1URL: https://fscdn.rohm.com/en/products/databook/datasheet/passive/resistor/chip_resistor/esr-e.pdf; ComponentLink2Description: DigiKey Link; ComponentLink2URL: https://www.digikey.com/en/products/detail/rohm-semiconductor/ESR01MZPF47R0/16180187; Composition: Thick Film; Device Package: 0402 (1005 Metric); Features: Automotive AEC-Q200, Pulse Withstanding; Height - Seated (Max): 0.016" (0.40mm); LastUpdated: 5.10.2023 19:23:22; Lifecycle Status: Active; Minimum Order: 1; Number of Terminations: 2; Operating Temperature: -55°C ~ 155°C; Package / Case: 0402 (1005 Metric); Packaging: TapeAndReel; PartId: 67421; Part Status: Active; Price: 0.03; Ratings: AEC-Q200; Resistance: 22 Ohms; Series: ESR; Size / Dimension: 0.039" L x 0.020" W (1.00mm x 0.50mm); Supplier 1: DigiKey; Supplier Part Number 1: 511-ESR01MZPF47R0CT-ND; Supplier Device Package: 0402

## Sheet DC-DC_Buck_Converter+12Vto+3.3V.SchDoc
size A4; SheetNumber: 3; SheetTotal: 10
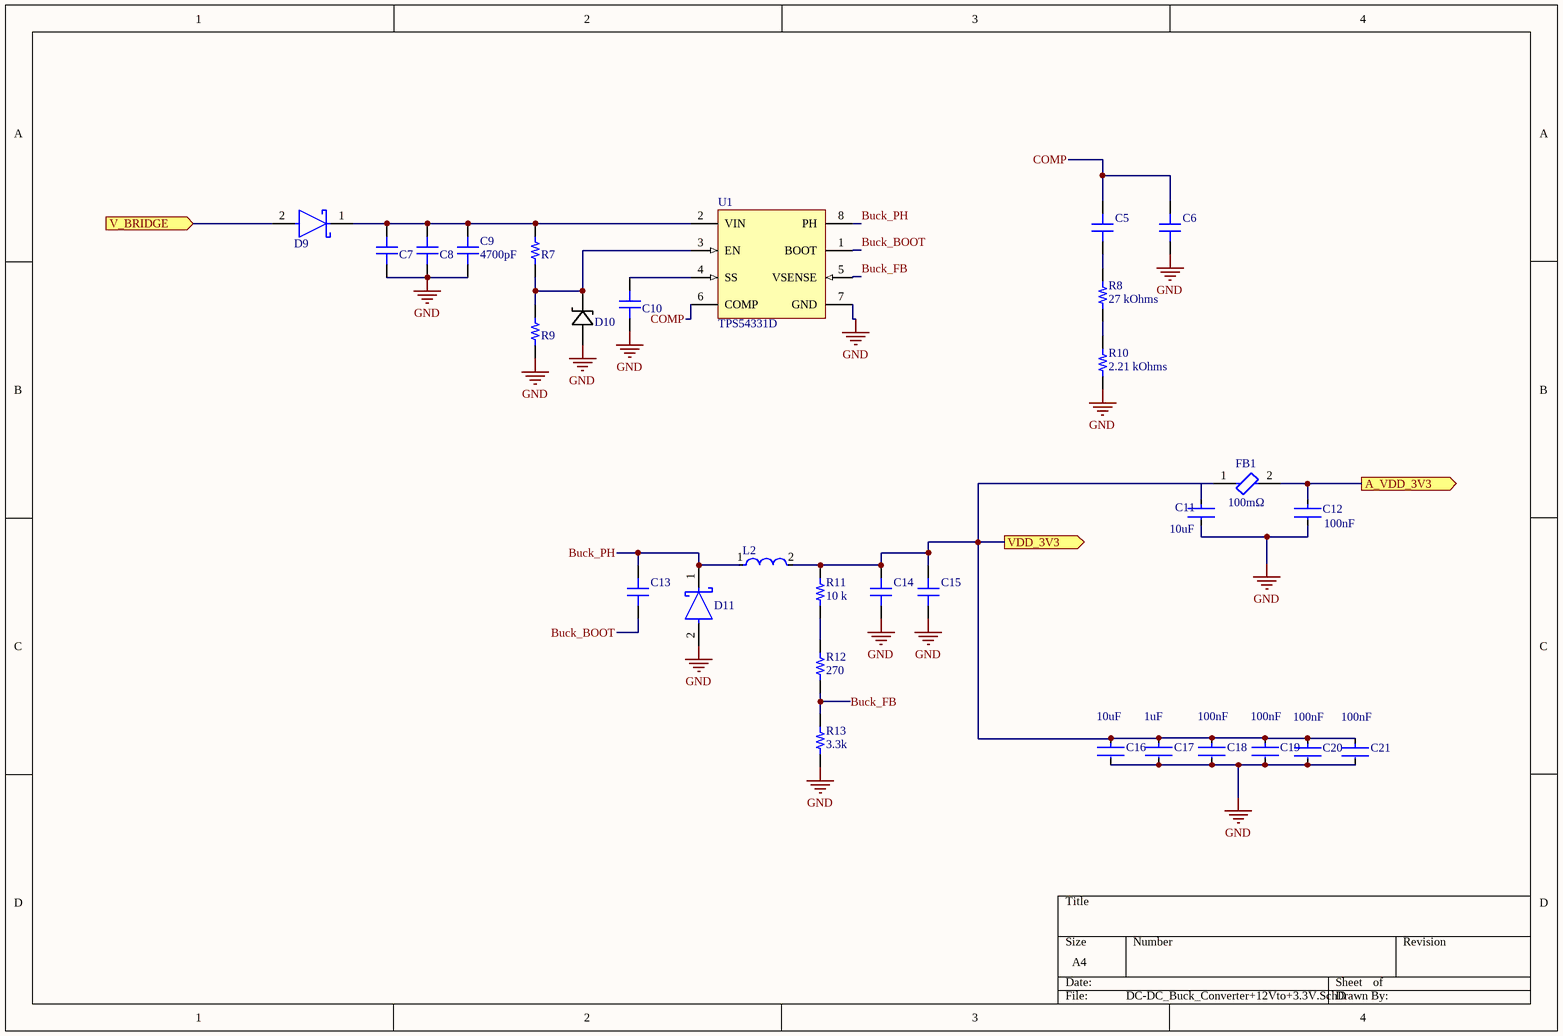
[diagram p4: DC-DC_Buck_Converter+12Vto+3.3V.SchDoc]

### Parts
C5  4700pF  [CAP 0603_1608]  (value not drawn)
C6  4700pF  [CAP 0603_1608]  (value not drawn)
C7  4700pF  [CAP 0603_1608]  (value not drawn)
C8  4700pF  [CAP 0603_1608]  (value not drawn)
C9  4700pF  [CAP 0603_1608]
C10  4700pF  [CAP 0603_1608]  (value not drawn)
C11  Capacitance: 10uF  [FP-GRM188-0_1-e0_2_0_55-IPC_A]  (hidden comment: GRM188R60J106ME47D)
C12  Capacitance: 100nF  [FP-GRM033-0_03-MFG]  (hidden comment: GRM033R60J104KE19D)
C13  1000pF  [CAP 0603_1608]  (value not drawn)
C14  1000pF  [CAP 0603_1608]  (value not drawn)
C15  1000pF  [CAP 0603_1608]  (value not drawn)
C16  Capacitance: 10uF  [FP-GRM188-0_1-e0_2_0_55-IPC_A]  (hidden comment: GRM188R60J106ME47D)
C17  value 1uF  [FP-GRM15-0_1-MFG]  (hidden comment: GRM155R61A105KE15D)
C18  Capacitance: 100nF  [FP-GRM033-0_03-MFG]  (hidden comment: GRM033R60J104KE19D)
C19  Capacitance: 100nF  [FP-GRM033-0_03-MFG]  (hidden comment: GRM033R60J104KE19D)
C20  Capacitance: 100nF  [FP-GRM033-0_03-MFG]  (hidden comment: GRM033R60J104KE19D)
C21  Capacitance: 100nF  [FP-GRM033-0_03-MFG]  (hidden comment: GRM033R60J104KE19D)
D9  SS34-E3/57T  [FP-95402-MFG]  (value not drawn)
D10  zmm3v3  [zmm5v6]  (value not drawn)
D11  SS34-E3/57T  [FP-95402-MFG]  (value not drawn)
FB1  Resistance: 100mΩ  [FP-MPZ2012-MFG]  (hidden comment: MPZ2012S601AT000)
L2  IHLP2525CZER6R8M01  [FP-IHLP-2525CZ-FP_2_413x3-MFG]  (value not drawn)
R7  15 kOhms  [RES 0805_2012]  (value not drawn)
R8  27 kOhms  [RES 0805_2012]
R9  15 kOhms  [RES 0805_2012]  (value not drawn)
R10  2.21 kOhms  [RES 0805_2012]
R11  10 k  [RES 0805_2012]
R12  270  [RES 0805_2012]
R13  3.3k  [RES 0805_2012]
U1  TPS54331D  [D0008A_L]

### Ports
A_VDD_3V3 (out, see MCU[1B]), V_BRIDGE (in, see DC_Current_Voltage_Measurement[3B], MotorDrivers[3C], Motors[1A], Power[4A]), VDD_3V3 (out, see ADC_Input_protection[3C], DC_Current_Voltage_Measurement[3B], MCU[1B], MotorDrivers[1A], MotorDrivers[1B], Power[1D], ZeroCrossing[1A])

### Nets
GND: C6.1 C7.1 C8.1 C9.1 C10.1 C11.2 C12.2 C14.2 C15.2 C16.2 C17.2 C18.2 C19.2 C20.2 C21.2 D10.2(ANODE) D11.2(A) R9.1 R10.1 R13.1 U1.7(GND)  [project net R_SHUNT1_N]
Buck_BOOT: C13.2 U1.1(BOOT)
Buck_FB: R12.1 R13.2 U1.5(VSENSE)
Buck_PH: C13.1 D11.1(C) L2.1 U1.8(PH)
COMP: C5.2 C6.2 U1.6(COMP)
NetC2_1: D9.2(A) ; port V_BRIDGE
NetC5_1: C5.1 R8.2
NetC7_2: C7.2 C8.2 C9.2 D9.1(C) R7.2 U1.2(VIN)
NetC10_2: C10.2 U1.4(SS)
NetC11_1: C11.1 C14.1 C15.1 C16.1 C17.1 C18.1 C19.1 C20.1 C21.1 FB1.1 L2.2 R11.2 ; port VDD_3V3
NetC12_1: C12.1 FB1.2 ; port A_VDD_3V3
NetD10_1: D10.1(CATHODE) R7.1 R9.2 U1.3(EN)
NetR8_1: R8.1 R10.2
NetR11_1: R11.1 R12.2

### Library data of the parts
C5-C10 = 06035C472JAT2A: CAP CER 4700PF 50V X7R 0603; manufacturer: AVX Corporation; Tolerance: ±5%; Part Number: 06035C472JAT2A; Value: 4700pF; Applications: General Purpose; Capacitance: 4700pF; componentlink1description: Datasheet; componentlink1url: http://datasheets.avx.com/X7RDielectric.pdf; componentlink2description: DigiKey Link; componentlink2url: http://digikey.com/product-detail/en/avx-corporation/06035C472JAT2A/478-10355-1-ND/6797516; Device Package: 0603 (1608 Metric); lastupdated: 2.09.2020 01:03:35; Lifecycle Status: Active; Minimum Order: 1; Mounting Type: Surface Mount, MLCC; Operating Temperature: -55°C ~ 125°C; Package / Case: 0603 (1608 Metric); packaging: TapeAndReel; partid: 2778; Part Status: Active; price: 0.02; series: -; Size / Dimension: 0.063" L x 0.032" W (1.60mm x 0.81mm); Supplier 1: DigiKey; Supplier Part Number 1: 478-10355-1-ND; Temperature Coefficient: X7R; Thickness (Max): 0.035" (0.90mm); Voltage - Rated: 50V
C11 C16 = CMP-2006-02792-2: Chip Multilayer Ceramic Capacitors for General Purpose, 0603, 10uF, X5R, 15%, 20%, 6.3V; Packaging: Tape and Reel; Voltage Rating (DC): 6.3V; Width: 0.031inch; Termination: SMD/SMT; Dielectric: X5R; Package Quantity: 4000; Voltage Rating: 6.3V; Case/Package: 0603; Min Operating Temperature: -55°C; Voltage: 6.3V; Length: 1.6mm; Thickness: 0.035inch; Lead Free: Lead Free; Depth: 0.8mm; Case Code (Imperial): 0603; Max Operating Temperature: 85°C; Material: Ceramic; Height: 0.8mm; Tolerance: 20%; Mount: Surface Mount; REACH SVHC: No SVHC; Radiation Hardening: No; Case Code (Metric): 1608
C12 C18-C21 = CMP-06035-000062-2: Chip Multilayer Ceramic Capacitors for General Purpose, 0201, 0.10uF, X5R, 15%, 10%, 6.3V; Min Operating Temperature: -55°C; Lead Free: Lead Free; Radiation Hardening: No; Dielectric: X5R; Voltage Rating (DC): 6.3V; REACH SVHC: No SVHC; Case/Package: 0201; Voltage Rating: 6.3V; Length: 0.6mm; Max Operating Temperature: 85°C; Width: 0.012inch; Depth: 0.3mm; Material: Ceramic; Case Code (Metric): 0603; Thickness: 0.013inch; Packaging: Tape and Reel; Height: 0.3mm; Weight: 6E-06oz; Package Quantity: 1; Mount: Surface Mount; Voltage: 6.3V; Case Code (Imperial): 0201; Tolerance: 10%; Termination: SMD/SMT
C13-C15 = 0603ZC102KAT2A: as C43 on sheet PhaseVoltage; Part Number: 0603ZC102KAT2A; Value: 1000pF; Applications: General Purpose; Capacitance: 1000pF; componentlink1description: Datasheet; componentlink1url: http://datasheets.avx.com/X7RDielectric.pdf; componentlink2description: DigiKey Link; componentlink2url: http://digikey.com/product-detail/en/avx-corporation/0603ZC102KAT2A/478-0603ZC102KAT2ACT-ND/11570315; Device Package: 0603 (1608 Metric); lastupdated: 2.09.2020 01:02:55; Lifecycle Status: Active; Minimum Order: 1; Mounting Type: Surface Mount, MLCC; Operating Temperature: -55°C ~ 125°C; Package / Case: 0603 (1608 Metric); packaging: TapeAndReel; partid: 27370; Part Status: Active; price: 0.01; series: -; Supplier 1: DigiKey; Supplier Part Number 1: 478-0603ZC102KAT2ACT-ND; Temperature Coefficient: X7R; Voltage - Rated: 10V
C17 = CMP-2008-04556-2: CAP CER 1UF 10V X5R 0402; Manufacturer: Murata; Material: Ceramic; Tolerance: 10%; Temperature Coefficient: 15%; Octopart: https://octopart.com/grm155r61a105ke15d-murata-197442; Manufacturer Part Number: GRM155R61A105KE15D; Lead Free: Yes; ComponentLink2Description: Datasheet; Temperature: -55°C to +85°C; Temperature Range High: +85°C; Height: 0.55mm; Capacitance: 1uF; Ipc Land Pattern Name: CAPC10050X50; ComponentLink2URL: https://search.murata.co.jp/Ceramy/image/img/A01X/G101/ENG/GRM155R61A105KE15-01A.pdf; Temperature Range Low: -55°C; Device Class L2: Capacitors; Voltage Rating: 10V; RoHS: TRUE; Device Class L1: Passive Components; Device Class L3: Ceramic Capacitors; Temperature Characteristic: X5R; Mouser Description: 0402 1 uF 10 V ±10% Tolerance X5R Surface Mount Multilayer Ceramic Capacitor; Automotive: No; Package: GRM15-0.1; Digikey Description: CAP CER 1UF 10V X5R 0402; Category: Cap
D9 D11 = CMP-02539-000012-1: DIODE SCHOTTKY 40V 3A DO214AB; Manufacturer: Vishay; Max Junction Temp: +150°C; Peak Reverse Current: 0.5mA; Max Surge Forward Current: 100A; Standoff Height: 0mm; ComponentLink2Description: Datasheet; Device Class L3: Schottky Diodes; Height: 2.62mm; Max Repetitive Reverse Voltage: 40V; Lead Free: Yes; Package: 95402; Temperature Range High: +150°C; ComponentLink2URL: http://www.vishay.com/docs/88751/ss32.pdf; Temperature: -55°C to +150°C; Footprint Url: http://www.vishay.com/docs/95402/smc.pdf; Automotive: No; Forward Current: 3A; Category: Diode; Manufacturer Part Number: SS34-E3/57T; RoHS: TRUE; Device Class L2: Diodes; Mouser Description: Schottky Diodes & Rectifiers 3.0 Amp 40 Volt; Octopart: https://octopart.com/ss34-e3%2F57t-vishay-39552907; Temperature Range Low: -55°C; Device Class L1: Discrete Semiconductors; Digikey Description: DIODE SCHOTTKY 40V 3A DO214AB
D10 = zmm5v6
FB1 = CMP-2000-05401-2: Manufacturer Lifecycle Status: PRODUCTION; NexarPartId: 12090955; RMS Current (Irms): 2A; Test Frequency: 100MHz; Tolerance: 25%; Core Material: Ferrite; Impedance: 600Ω; Packaging: Digi-Reel®; Length: 2mm; Min Operating Temperature: -55°C; Width: 1.25mm; Max Width: 1.45mm; Lead Free: Lead Free; Current Rating: 2A; Case Code (Imperial): 0805; Min Length: 1.8mm; Schedule B: 8504500000, 8504500000; Series Resistance: 100mΩ; REACH SVHC: No SVHC; Case Code (Metric): 2012; Max DC Current: 2A; Case/Package: 0805; Lifecycle Status: Production; Min Width: 1.05mm; Mount: Surface Mount; Height: 1.0414mm; DC Resistance (DCR): 100mΩ; Max Operating Temperature: 125°C; Max Length: 2.2mm; RoHS: Compliant
L2 = CMP-02424-000104-1: Commercial Inductors, High Saturation Series 6.8uH 4.5A 60mΩ 20%; Saturation Current: 8A; Self Resonant Frequency: 5MHz; Core Material: Metal; DC Resistance (DCR): 60mR; Test Frequency: 100kHz; Shielding: Shielded; Number of Pins: 2; Tolerance: 20%; Max DC Current: 8A; Max Operating Temperature: 125°C; Radiation Hardening: No; Inductance: 6.8uH; Contact Plating: Tin; RMS Current (Irms): 4.5A; Case/Package: 2525; Inductance Tolerance: 20%; Case Code (Metric): 6363; Lead Free: Lead Free; Package Quantity: 2000; Current Rating: 4.5A; Case Code (Imperial): 2525; Height - Seated (Max): 0.118inch; Height: 3mm; Mount: Surface Mount; Depth: 6.72mm; Military Standard: Not; Packaging: Tape and Reel; Min Operating Temperature: -55°C; Width: 0.255inch; Length: 7.24mm; Termination: SMD/SMT
R7 R9 = PTN0805Y1502BST1: PTN0805 10PPM 15K 0.1% S T1 E1; Manufacturer: Vishay Dale Thin Film; Power (Watts): 0.2W, 1/5W; Temperature Coefficient: ±10ppm/°C; Part Number: PTN0805Y1502BST1; Value: 15 kOhms; ComponentLink1Description: Datasheet; ComponentLink1URL: https://www.vishay.com/docs/60026/ptn.pdf; ComponentLink2Description: DigiKey Link; ComponentLink2URL: https://www.digikey.com/en/products/detail/vishay-dale-thin-film/PTN0805Y1502BST1/12820709; Composition: Thin Film; Device Package: 0805 (2012 Metric); Features: Anti-Sulfur, Moisture Resistant, Non-Inductive; Height - Seated (Max): 0.033" (0.84mm); LastUpdated: 3.10.2023 19:53:28; Lifecycle Status: Active; Minimum Order: 1; Number of Terminations: 2; Operating Temperature: -55°C ~ 155°C; Package / Case: 0805 (2012 Metric); Packaging: TapeAndReel; PartId: 61260; Part Status: Active; Price: 0.29; Resistance: 15 kOhms; Series: PTN; Size / Dimension: 0.080" L x 0.050" W (2.03mm x 1.27mm); Supplier 1: DigiKey; Supplier Part Number 1: 764-PTN0805Y1502BST1CT-ND; Supplier Device Package: 0805; Tolerance: ±0.1%
R8 = RMCF0805FT27K0: RES 27K OHM 1% 1/8W 0805; Manufacturer: Stackpole Electronics Inc; Power (Watts): 0.125W, 1/8W; Temperature Coefficient: ±100ppm/°C; Part Number: RMCF0805FT27K0; Value: 27 kOhms; ComponentLink1Description: Datasheet; ComponentLink1URL: https://www.seielect.com/catalog/sei-packaging.pdf; ComponentLink2Description: DigiKey Link; ComponentLink2URL: https://www.digikey.com/en/products/detail/stackpole-electronics-inc/RMCF0805FT27K0/1712930; Composition: Thick Film; Device Package: 0805 (2012 Metric); Features: Automotive AEC-Q200; Height - Seated (Max): 0.026" (0.65mm); LastUpdated: 3.10.2023 19:54:39; Lifecycle Status: Active; Minimum Order: 1; Number of Terminations: 2; Operating Temperature: -55°C ~ 155°C; Package / Case: 0805 (2012 Metric); Packaging: CutTape; PartId: 38336; Part Status: Active; Price: 0.01; Ratings: AEC-Q200; Resistance: 27 kOhms; Series: RMCF; Size / Dimension: 0.079" L x 0.049" W (2.00mm x 1.25mm); Supplier 1: DigiKey; Supplier Part Number 1: RMCF0805FT27K0CT-ND; Supplier Device Package: 0805; Tolerance: ±1%
R10 = RMCF0805FG2K21: RES 2.21K OHM 1% 1/8W 0805; Manufacturer: Stackpole Electronics Inc; Power (Watts): 0.125W, 1/8W; Temperature Coefficient: ±100ppm/°C; Part Number: RMCF0805FG2K21; Value: 2.21 kOhms; ComponentLink1Description: Datasheet; ComponentLink1URL: https://www.seielect.com/catalog/sei-rmcf_rmcp.pdf; ComponentLink2Description: DigiKey Link; ComponentLink2URL: https://www.digikey.com/en/products/detail/stackpole-electronics-inc/RMCF0805FG2K21/1712795; Composition: Thick Film; Device Package: 0805 (2012 Metric); Features: Automotive AEC-Q200; Height - Seated (Max): 0.026" (0.65mm); LastUpdated: 3.10.2023 19:55:04; Lifecycle Status: Active; Minimum Order: 1; Number of Terminations: 2; Operating Temperature: -55°C ~ 155°C; Package / Case: 0805 (2012 Metric); Packaging: CutTape; PartId: 31688; Part Status: Active; Price: 0.01; Ratings: AEC-Q200; Resistance: 2.21 kOhms; Series: RMCF; Size / Dimension: 0.079" L x 0.049" W (2.00mm x 1.25mm); Supplier 1: DigiKey; Supplier Part Number 1: RMCF0805FG2K21CT-ND; Supplier Device Package: 0805; Tolerance: ±1%
R11-R13 = RMCF0805FT27K0: RES 27K OHM 1% 1/8W 0805; Manufacturer: Stackpole Electronics Inc; Power (Watts): 0.125W, 1/8W; Resistance: 27 kOhms; Temperature Coefficient: ±100ppm/°C; Part Number: RMCF0805FT27K0; ComponentLink1Description: Datasheet; ComponentLink1URL: https://www.seielect.com/catalog/sei-packaging.pdf; ComponentLink2Description: DigiKey Link; ComponentLink2URL: https://www.digikey.com/en/products/detail/stackpole-electronics-inc/RMCF0805FT27K0/1712930; Composition: Thick Film; Device Package: 0805 (2012 Metric); Features: Automotive AEC-Q200; Height - Seated (Max): 0.026" (0.65mm); LastUpdated: 3.10.2023 19:54:39; Lifecycle Status: Active; Minimum Order: 1; Number of Terminations: 2; Operating Temperature: -55°C ~ 155°C; Package / Case: 0805 (2012 Metric); Packaging: CutTape; PartId: 38336; Part Status: Active; Price: 0.01; Ratings: AEC-Q200; Series: RMCF; Size / Dimension: 0.079" L x 0.049" W (2.00mm x 1.25mm); Supplier 1: DigiKey; Supplier Part Number 1: RMCF0805FT27K0CT-ND; Supplier Device Package: 0805; Tolerance: ±1%
  R11: Value: 10 k
  R12: Value: 270
  R13: Value: 3.3k
U1 = CMP-0323-00203-3: Buck Step Down Regulator with 3.5 to 28 V Input and 0.8 to 25 V Output, -40 to 150 degC, 8-Pin SOIC (D), Green (RoHS & no Sb/Br); Manufacturer: Texas Instruments; Regulated Outputs(#): 1; Vout(Min)(V): 0.8; Iout(Max)(A): 3; Vin(Min)(V): 3.5; Rating: Catalog; SubFamily: Step-Down Regulator; Vout(Max)(V): 25; Iq(Typ)(mA): 0.11; Vin(Max)(V): 28; Duty Cycle(Max)(%): 90; ComponentLink3Description: URL Link1; ComponentLink1URL: http://www.ti.com/general/docs/lit/getliterature.tsp?genericPartNumber=TPS54331&fileType=pdf; Code_JEDEC: MS-012AA; PartNumber: TPS54331D; PackageVersion: revM, Jun-2011; ComponentLink1Description: Datasheet; PackageReference: D0008A; Eco-Plan: Green (RoHS & no Sb/Br); PackageDescription: 8-Pin Plastic Small Outline Integrated Circuit, 4.9 x 3.9 mm, Pitch 1.27 mm Pitch; ComponentLink2URL: http://www.ti.com/litv/pdf/msoi002j; DatasheetVersion: SLVS839D; Topology: Buck; Switch Current Limit(Typ)(A): 3.5; ComponentLink3URL: Samples URL:http://www.ti.com/product/tps54331#samples; ComponentLink2Description: Package Specification; Mounting Technology: Surface Mount